# Altium schematic sheet A.SchDoc
size A4
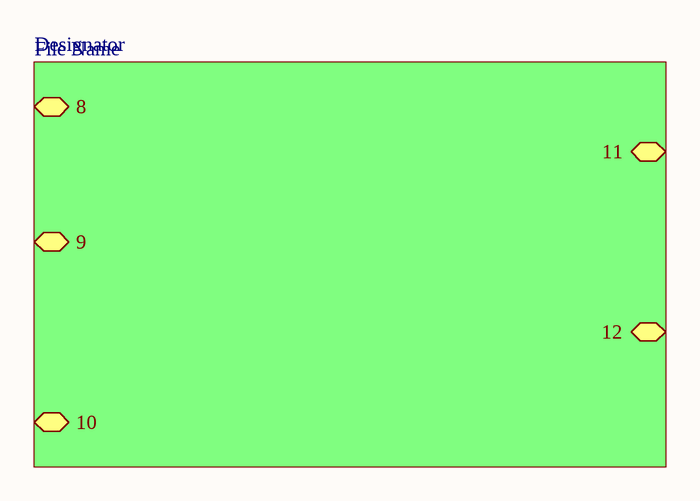
[diagram p0: A.SchDoc]

## Sub-sheets
Designator = File Name: 8 (harness balance), 9 (harness chaining), 10 (harness thermo), 11, 12